# EAGLE design T07 -BOARD V7 (EAGLE 7.7.0)
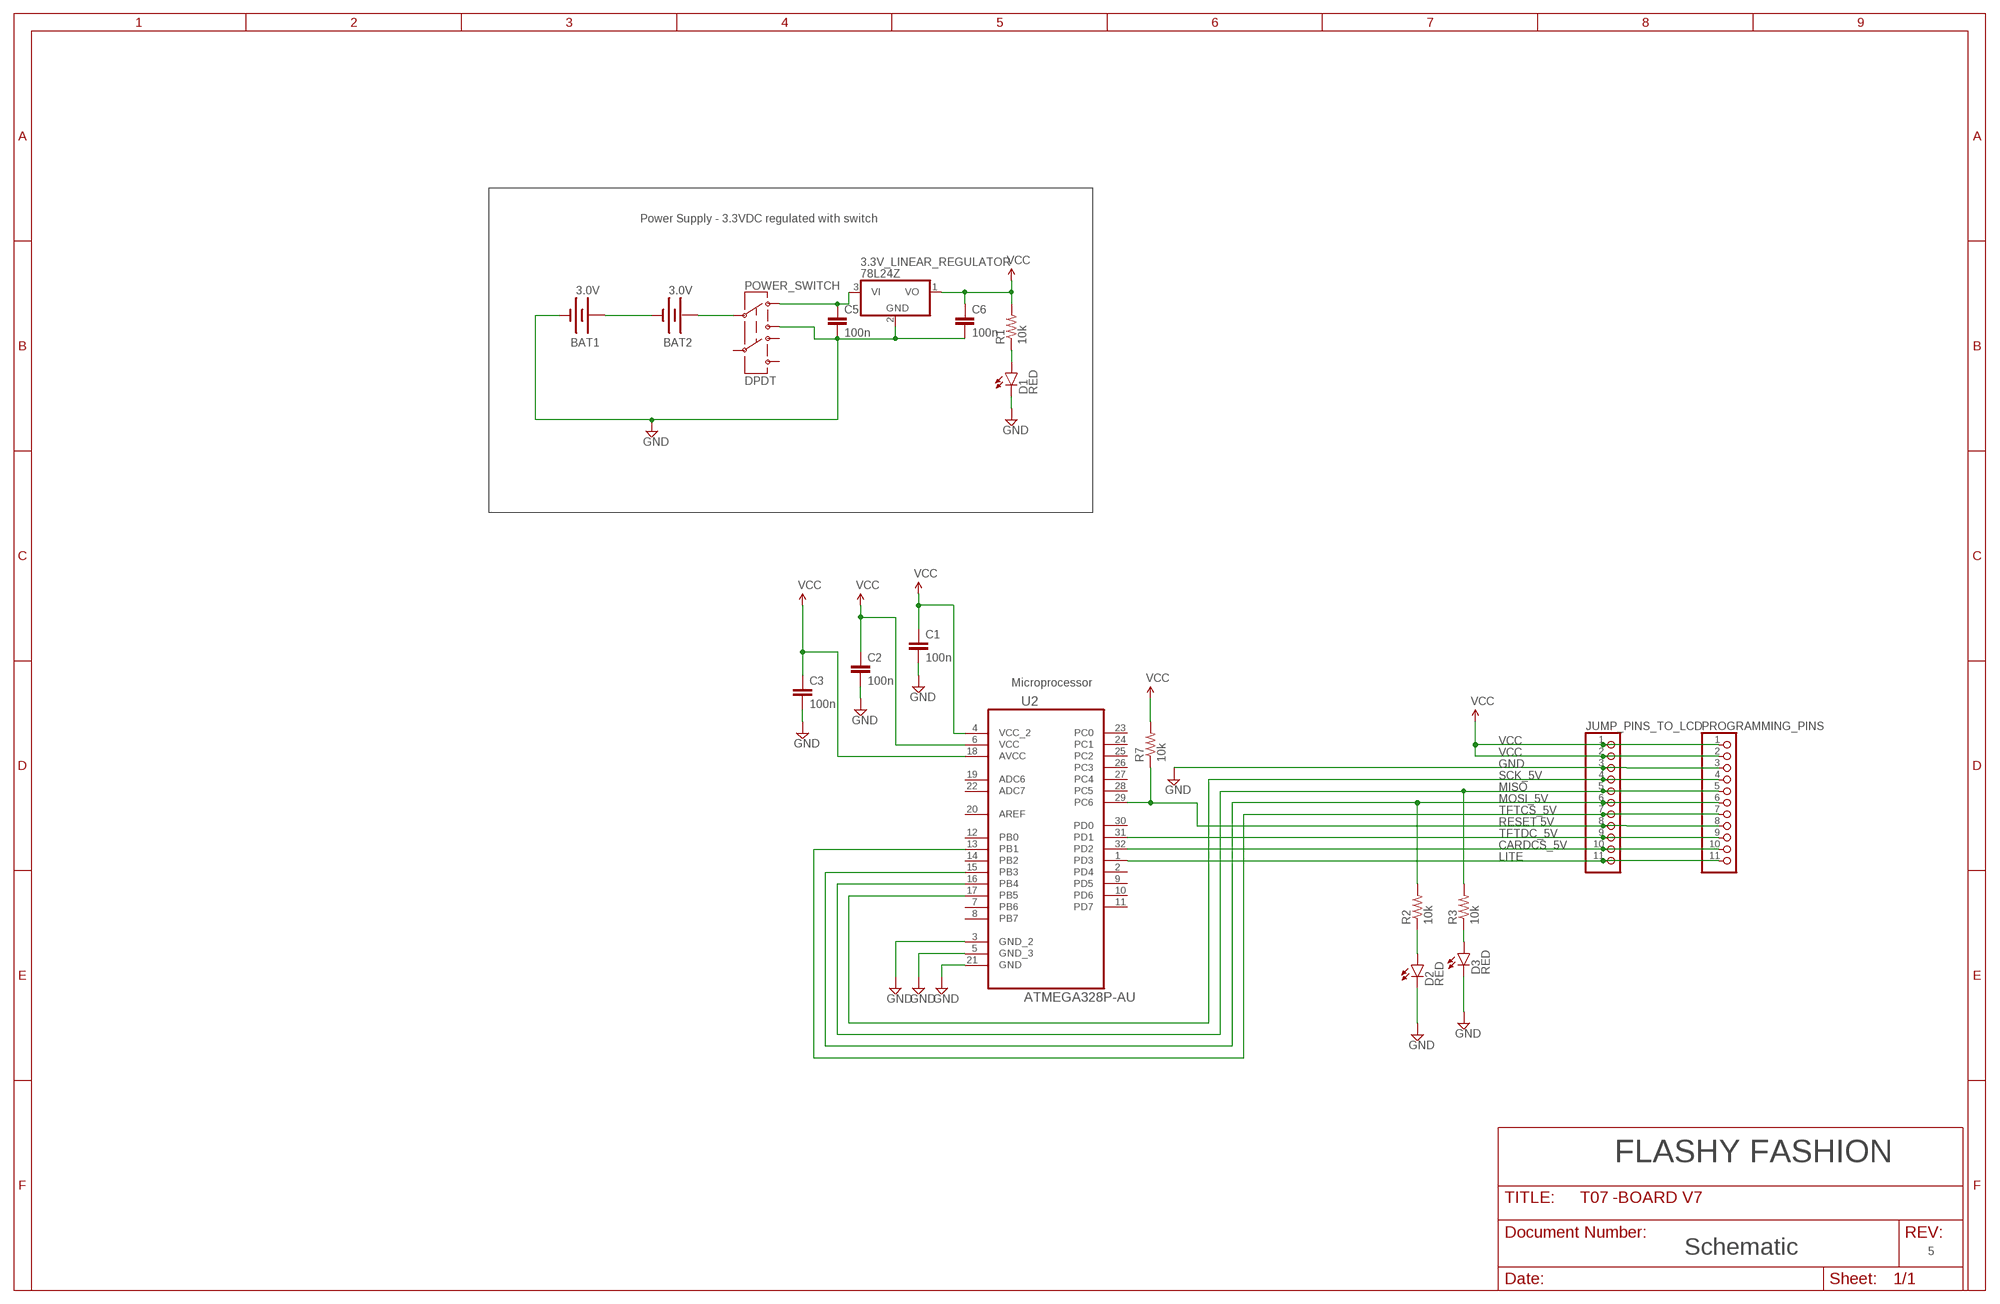
[diagram p0: schematic, sheet 1]

## Parts
3.3V_LINEAR_REGULATOR  78L24Z  [TO92]
BAT1  3.0V  BATTERY245PTH  [BATTCON_245MM_PTH]
BAT2  3.0V  BATTERY245PTH  [BATTCON_245MM_PTH]
C1  100n  CAP1206  [1206]
C2  100n  CAP1206  [1206]
C3  100n  CAP1206  [1206]
C5  100n  CAP1206  [1206]
C6  100n  CAP1206  [1206]
D1  RED  LED-BLUE1206  [LED-1206]
D2  RED  LED-BLUE1206  [LED-1206]
D3  RED  LED-BLUE1206  [LED-1206]
JUMP_PINS_TO_LCD  HEADER-1X1176MIL  [1X11_ROUND_76]
POWER_SWITCH  DPDT  SWITCH-DPDTAYZ0202  [AYZ0202]
PROGRAMMING_PINS  HEADER-1X1176MIL  [1X11_ROUND_76]
R1  10k  RESISTOR1206  [1206]
R2  10k  RESISTOR1206  [1206]
R3  10k  RESISTOR1206  [1206]
R7  10k  RESISTOR1206  [1206]
U2  ATMEGA328P-AU  [QFP80P900X900X120-32N]

## Nets
CARDCS_5V: JUMP_PINS_TO_LCD.10 PROGRAMMING_PINS.10 U2.32(PD2)
GND: 3.3V_LINEAR_REGULATOR.2(GND) BAT1.2(-) C1.2 C2.2 C3.2 C5.2 C6.2 D1.C D2.C D3.C JUMP_PINS_TO_LCD.3 POWER_SWITCH.3 PROGRAMMING_PINS.3 U2.3(GND_2) U2.5(GND_3) U2.21(GND)
LITE: JUMP_PINS_TO_LCD.11 PROGRAMMING_PINS.11 U2.1(PD3)
MISO: JUMP_PINS_TO_LCD.5 PROGRAMMING_PINS.5 R3.2 U2.16(PB4)
MOSI_5V: JUMP_PINS_TO_LCD.6 PROGRAMMING_PINS.6 R2.2 U2.15(PB3)
N$1: BAT1.3(+) BAT2.2(-)
N$2: JUMP_PINS_TO_LCD.8 PROGRAMMING_PINS.8 R7.1 U2.29(PC6)
N$3: D1.A R1.1
N$6: BAT2.3(+) POWER_SWITCH.2
N$7: 3.3V_LINEAR_REGULATOR.3(VI) C5.1 POWER_SWITCH.1
N$8: D2.A R2.1
N$9: D3.A R3.1
SCK_5V: JUMP_PINS_TO_LCD.4 PROGRAMMING_PINS.4 U2.17(PB5)
TFTCS_5V: JUMP_PINS_TO_LCD.7 PROGRAMMING_PINS.7 U2.13(PB1)
TFTDC_5V: JUMP_PINS_TO_LCD.9 PROGRAMMING_PINS.9 U2.31(PD1)
VCC: 3.3V_LINEAR_REGULATOR.1(VO) C1.1 C2.1 C3.1 C6.1 JUMP_PINS_TO_LCD.1 JUMP_PINS_TO_LCD.2 PROGRAMMING_PINS.1 PROGRAMMING_PINS.2 R1.2 R7.2 U2.4(VCC_2) U2.6(VCC) U2.18(AVCC)
Unconnected: POWER_SWITCH.4 POWER_SWITCH.5 POWER_SWITCH.6 U2.2(PD4) U2.7(PB6) U2.8(PB7) U2.9(PD5) U2.10(PD6) U2.11(PD7) U2.12(PB0) U2.14(PB2) U2.19(ADC6) U2.20(AREF) U2.22(ADC7) U2.23(PC0) U2.24(PC1) U2.25(PC2) U2.26(PC3) U2.27(PC4) U2.28(PC5) U2.30(PD0)

## Notes on the sheet
- Power Supply - 3.3VDC regulated with switch
- Microprocessor
- RESET 5V
- FLASHY FASHION
- Schematic | 5

## Library data of the parts
3.3V_LINEAR_REGULATOR = adafruit:78*: Positive VOLTAGE REGULATOR Added bigger pads to the TO-92 package
BAT1 BAT2 = SparkFun-Electromechanical:BATTERY: Battery Holders Various common sizes : AA, AAA, 18650 (PRT-12895), 20mm coin cell and 12mm coin cell. 20MM_4LEGS, BATT-10373
C1-C3 C5 = SparkFun-Capacitors:CAP: Capacitor Standard 0603 ceramic capacitor, and 0.1" leaded capacitor.
C6 = SparkFun-Passives:CAP: Capacitor Standard 0603 ceramic capacitor, and 0.1" leaded capacitor.
D1-D3 = SparkFun-LED:LED-BLUE: Blue LEDs for production use Various blue LEDs stocked by SparkFun production 0603 - DIO-08575 Rebel - DIO-09553 1206 - DIO-09911; PROD_ID: DIO-09911; VALUE: BLUE
JUMP_PINS_TO_LCD PROGRAMMING_PINS = microbuilder:HEADER-1X11
POWER_SWITCH = SparkFun-Electromechanical:SWITCH-DPDT: DPDT Version of the COM-00597; PROD_ID: SWCH-08179
R1-R3 = SparkFun-Resistors:RESISTOR: Resistor Basic schematic elements and footprints for 0603, 1206, and PTH resistors.
R7 = SparkFun-Passives:RESISTOR: Resistor Basic schematic elements and footprints for 0603, 1206, and PTH resistors.
U2 = Atmel_By_element14_Batch_1-00:ATMEGA328P-AU: 8-bit Microcontroller with In-System Programmable Flash; MPN: ATMEGA328P-AU; OC_FARNELL: 1715486; OC_NEWARK: 14R4631; PACKAGE: TQFP-32; SUPPLIER: Atmel

## Net classes
1 power: width 0.406 mm

## Board
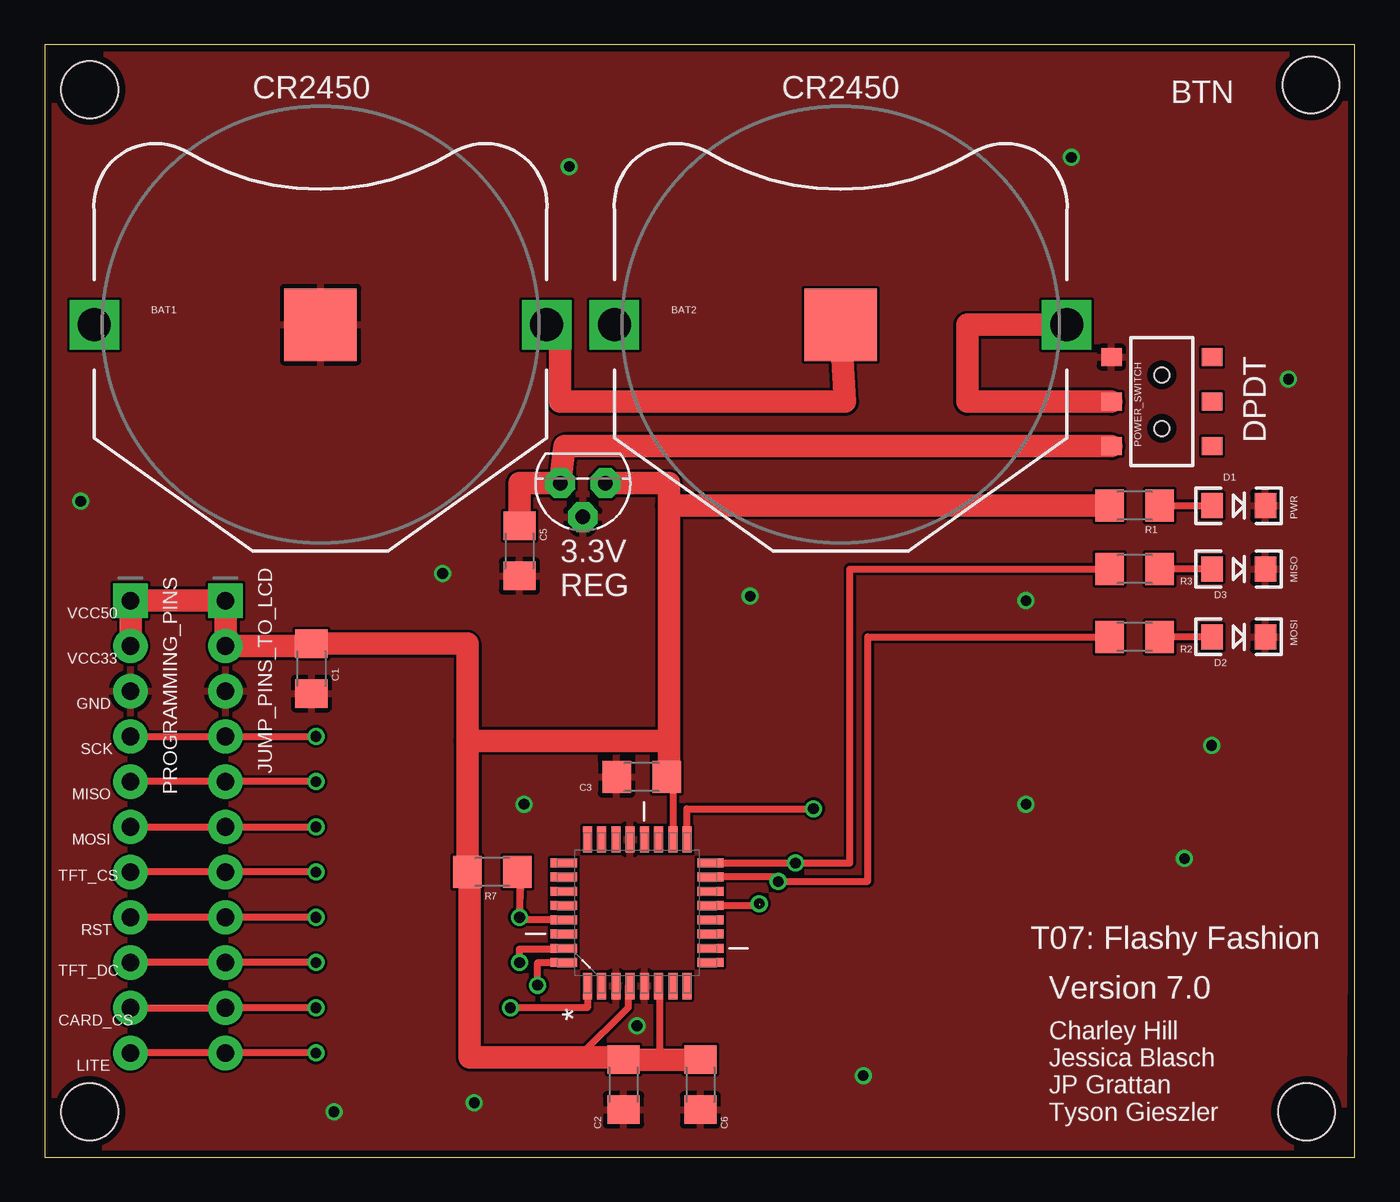
[diagram p1: board, top side]
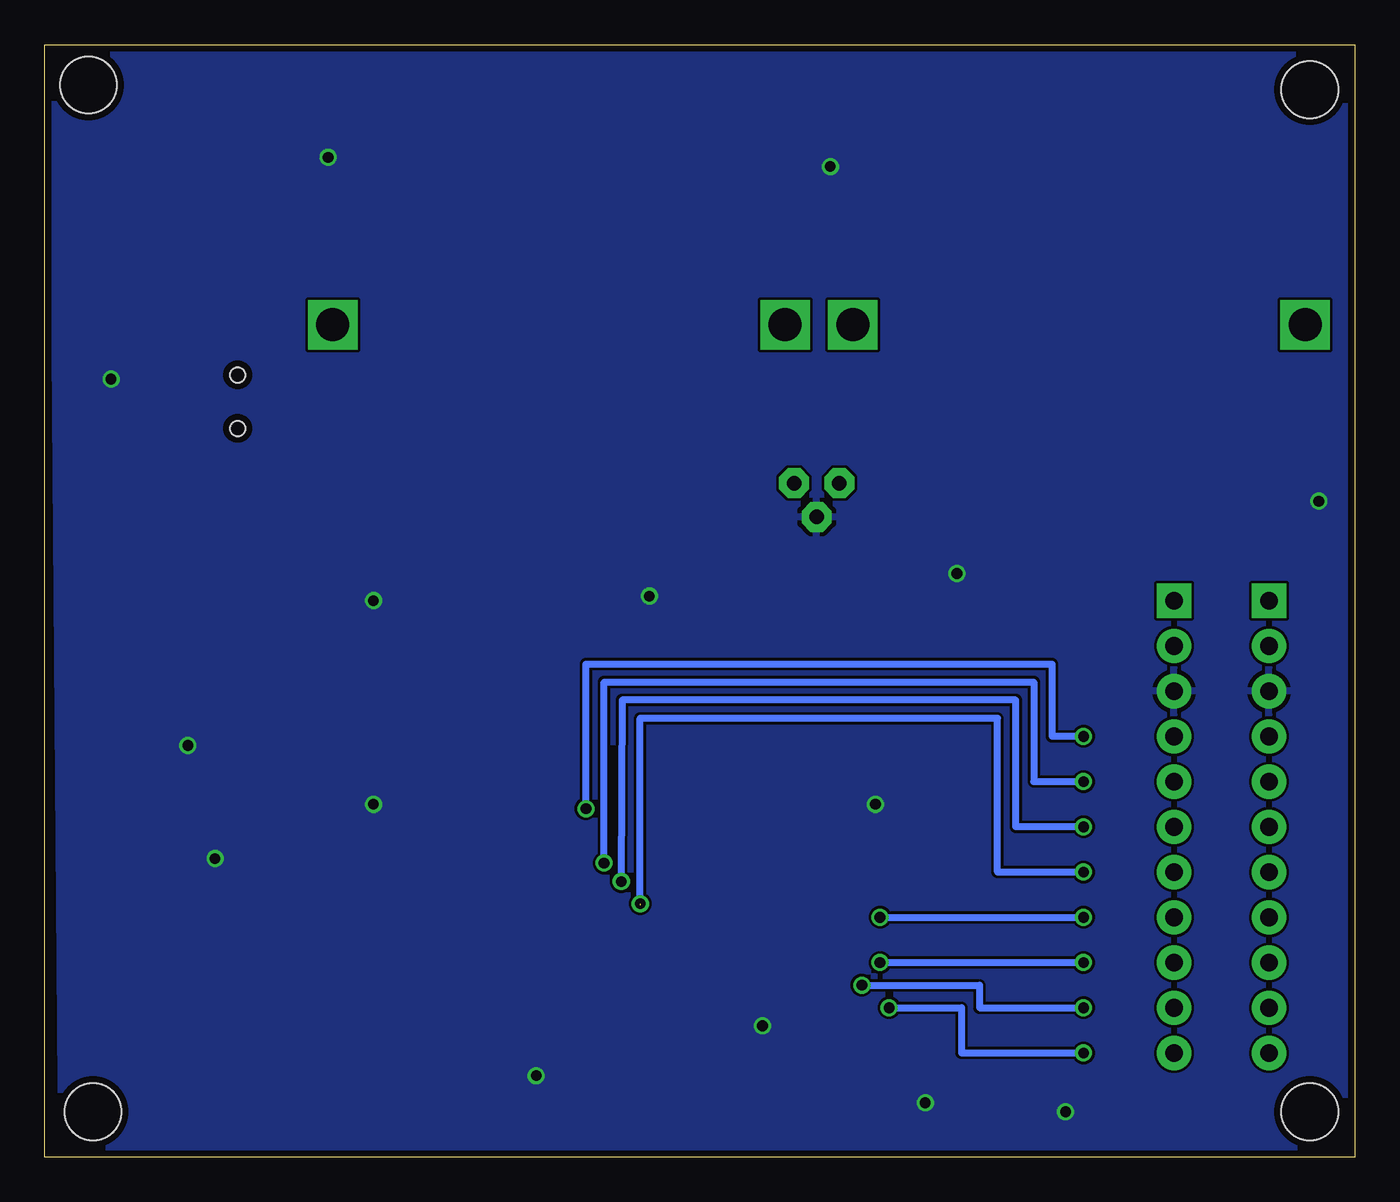
[diagram p2: board, bottom side, seen from below]

Size 73.58 x 62.47 mm. Coordinates in mm from the lower left corner, seen from the top.
Outline: 0,0 73.58,0 73.58,62.47 0,62.47 0,0
Copper layers (1*16): Top 0.0356mm / dielectric 1.5011mm / Bottom 0.0356mm
Design rules "tysons_rules": minimum track width 6mil, minimum drill 13mil, track to track 6mil, track to pad 6mil, pad to pad 6mil, via to via 6mil, smd to smd 6mil, copper to edge 15mil, drill to drill 6mil, minimum pad ring 7mil, minimum via ring 7mil, stop-mask expansion 2.5mil, vias tented up to drill 0mil, thermal gap 10mil
Holes 3.2 mm at 2.54,59.94 2.54,2.54 70.87,2.54 71.12,60.2

### Footprints (pad centres in the part's own frame; a part is rotated, then mirrored left to right if it is on the bottom)
TO92 = drill 0.813 pad 1.676 octagon: 1 -1.27,0; 2 0,1.905; 3 1.27,0
BATTCON_245MM_PTH = drill 1.854 square: 1 -12.7,0; 3 12.7,0 | smd 4.064 x 4.064: 2 0,0
1206 = smd 1.6 x 1.8: 1 -1.4,0; 2 1.4,0
LED-1206 = smd 1.2 x 1.4: A -1.5,0; C 1.5,0
1X11_ROUND_76 = drill 1 pad 1.93 square: 1 -12.7,0 | drill 1 pad 1.93: 2 -10.16,0; 3 -7.62,0; 4 -5.08,0; 5 -2.54,0; 6 0,0; 7 2.54,0; 8 5.08,0; 9 7.62,0; 10 10.16,0; 11 12.7,0
AYZ0202 = smd 1 x 1.15: 1 -2.5,2.825; 2 0,2.825; 3 2.5,2.825; 4 -2.5,-2.825; 5 0,-2.825; 6 2.5,-2.825 | hole 0.85: 1.5,0; -1.5,0
QFP80P900X900X120-32N = smd 1.473 x 0.508: 1 -4.115,2.794; 2 -4.115,2.007; 3 -4.115,1.194; 4 -4.115,0.406; 5 -4.115,-0.406; 6 -4.115,-1.194; 7 -4.115,-2.007; 8 -4.115,-2.794; 17 4.115,-2.794; 18 4.115,-2.007; 19 4.115,-1.194; 20 4.115,-0.406; 21 4.115,0.406; 22 4.115,1.194; 23 4.115,2.007; 24 4.115,2.794 | smd 0.508 x 1.473: 9 -2.794,-4.115; 10 -2.007,-4.115; 11 -1.194,-4.115; 12 -0.406,-4.115; 13 0.406,-4.115; 14 1.194,-4.115; 15 2.007,-4.115; 16 2.794,-4.115; 25 2.794,4.115; 26 2.007,4.115; 27 1.194,4.115; 28 0.406,4.115; 29 -0.406,4.115; 30 -1.194,4.115; 31 -2.007,4.115; 32 -2.794,4.115

### Placement (x,y rotation side)
3.3V_LINEAR_REGULATOR  30.23,37.85 180 top
BAT1  15.49,46.74 0 top
BAT2  44.7,46.74 0 top
C1  14.99,27.43 270 top
C2  32.51,4.06 270 top
C3  33.53,21.34 180 top
C5  26.67,34.04 270 top
C6  36.83,4.06 270 top
D1  67.06,36.58 0 top
D2  67.06,29.21 0 top
D3  67.06,33.02 0 top
JUMP_PINS_TO_LCD  10.16,18.54 270 top
POWER_SWITCH  62.74,42.42 90 top
PROGRAMMING_PINS  4.83,18.54 270 top
R1  61.21,36.58 180 top
R2  61.21,29.21 180 top
R3  61.21,33.02 180 top
R7  25.15,16 180 top
U2  33.27,13.72 90 top

### Tracks (layer width: path | path; a pad name or v marks a point on that pad's centre or on a via)
CARDCS_5V  (via drill 0.6)
  Top 0.406: PROGRAMMING_PINS.10 JUMP_PINS_TO_LCD.10 v15.24,8.38 | v27.69,9.65 27.69,10.92 U2.32
  Bottom 0.406: v27.69,9.65 21.08,9.65 21.08,8.38 v15.24,8.38
GND  (via drill 0.6)
  other vias: 2.03,36.83 29.46,55.63 57.66,56.13 69.85,43.69 39.62,31.5 22.35,32.77 55.12,31.24 55.12,19.81 64.01,16.76 65.53,23.11 45.97,4.57 33.27,7.37 24.13,3.05 16.26,2.54 26.92,19.81
  pour Bottom: 0.25,62.23 73.15,62.48 72.64,0.51 0.25,0.25
  pour Top: 0.51,62.48 73.41,62.48 72.9,0.51 0.25,0.25
LITE  (via drill 0.6)
  Top 0.406: PROGRAMMING_PINS.11 JUMP_PINS_TO_LCD.11 v15.24,5.84 | U2.1 30.48,8.38 v26.16,8.38
  Bottom 0.406: v26.16,8.38 22.1,8.38 22.1,5.84 v15.24,5.84
MISO  (via drill 0.6)
  Top 0.406: PROGRAMMING_PINS.5 JUMP_PINS_TO_LCD.5 v15.24,21.08 | U2.16 v42.16,16.51 45.21,16.51 45.21,33.02 R3.2
  Bottom 0.406: v42.16,16.51 42.16,26.67 18.03,26.67 18.03,21.08 v15.24,21.08
MOSI_5V  (via drill 0.6)
  Top 0.406: PROGRAMMING_PINS.6 JUMP_PINS_TO_LCD.6 v15.24,18.54 | R2.2 46.23,29.21 46.23,15.49 v41.2,15.47 41.15,15.49 41.15,15.75 37.85,15.75 U2.15
  Bottom 0.406: v15.24,18.54 19.05,18.54 19.05,25.65 41.15,25.65 v41.2,15.47
N$1
  Top 1.27: BAT1.3 28.96,46.74 28.96,42.42 44.96,42.42 BAT2.2
N$2  (via drill 0.6)
  Top 0.406: U2.29 26.67,13.31 v26.67,13.46 | v26.67,13.46 26.67,13.72 26.8,15.75 R7.1 26.67,15.75 v26.67,13.46 | v15.24,13.46 JUMP_PINS_TO_LCD.8 PROGRAMMING_PINS.8
  Bottom 0.406: v26.67,13.46 v15.24,13.46
N$3
  Top 0.406: R1.1 D1.A
N$6
  Top 1.27: POWER_SWITCH.2 51.82,42.42 51.82,46.74 BAT2.3
N$7
  Top 1.27: POWER_SWITCH.1 29.21,39.92 3.3V_LINEAR_REGULATOR.3 26.67,37.85 C5.1
N$8
  Top 0.406: D2.A R2.1
N$9
  Top 0.406: D3.A R3.1
SCK_5V  (via drill 0.6)
  Top 0.406: PROGRAMMING_PINS.4 JUMP_PINS_TO_LCD.4 v15.24,23.62 | U2.17 36.07,19.56 v43.18,19.56
  Bottom 0.406: v43.18,19.56 43.18,27.69 17.02,27.69 17.02,23.62 v15.24,23.62
TFTCS_5V  (via drill 0.6)  (1 unrouted)
  Top 0.406: U2.13 40.13,14.12 | v15.24,16 JUMP_PINS_TO_LCD.7 PROGRAMMING_PINS.7
  Bottom 0.406: v40.13,14.22 40.13,24.64 20.07,24.64 20.07,16 v15.24,16
TFTDC_5V  (via drill 0.6)
  Top 0.406: v15.24,10.92 JUMP_PINS_TO_LCD.9 PROGRAMMING_PINS.9 | v26.67,10.92 26.67,11.68 28.7,11.68 U2.31
  Bottom 0.406: v26.67,10.92 v15.24,10.92
VCC
  Top 0.406: 35.28,21.08 35.28,20.83 | 35.28,20.83 U2.18 | 34.47,9.35 U2.6 34.54,9.6 34.54,5.46 | U2.4 32.77,9.6 32.77,8.38 29.97,5.59 | C3.1 35.28,20.83
  Top 1.27: PROGRAMMING_PINS.2 PROGRAMMING_PINS.1 JUMP_PINS_TO_LCD.1 JUMP_PINS_TO_LCD.2 14.99,28.7 C1.1 23.75,28.83 23.75,23.37 | 23.75,23.37 R7.2 23.88,15.75 23.88,5.59 29.97,5.59 32.51,5.59 C2.1 34.54,5.46 C6.1 | 3.3V_LINEAR_REGULATOR.1 35.05,37.85 35.05,36.58 | 35.05,36.58 35.05,23.37 | 35.05,23.37 35.05,21.59 | 35.05,21.59 C3.1 | R1.2 35.05,36.58 | 35.05,23.37 23.75,23.37 | 35.05,21.59 35.05,21.08

### Text on the board
tNames: CR2450 | CR2450 | BTN | DPDT | PWR | MISO | 3.3V / REG | VCC50 | MOSI | VCC33 | GND | SCK | MISO | MOSI | TFT_CS | RST | T07: Flashy Fashion | TFT_DC | Version 7.0 | CARD_CS | LITE | Charley Hill / Jessica Blasch / JP Grattan / Tyson Gieszler